# EAGLE design amiga_external_floppy_adapter_rev1 (EAGLE 9.7.0)
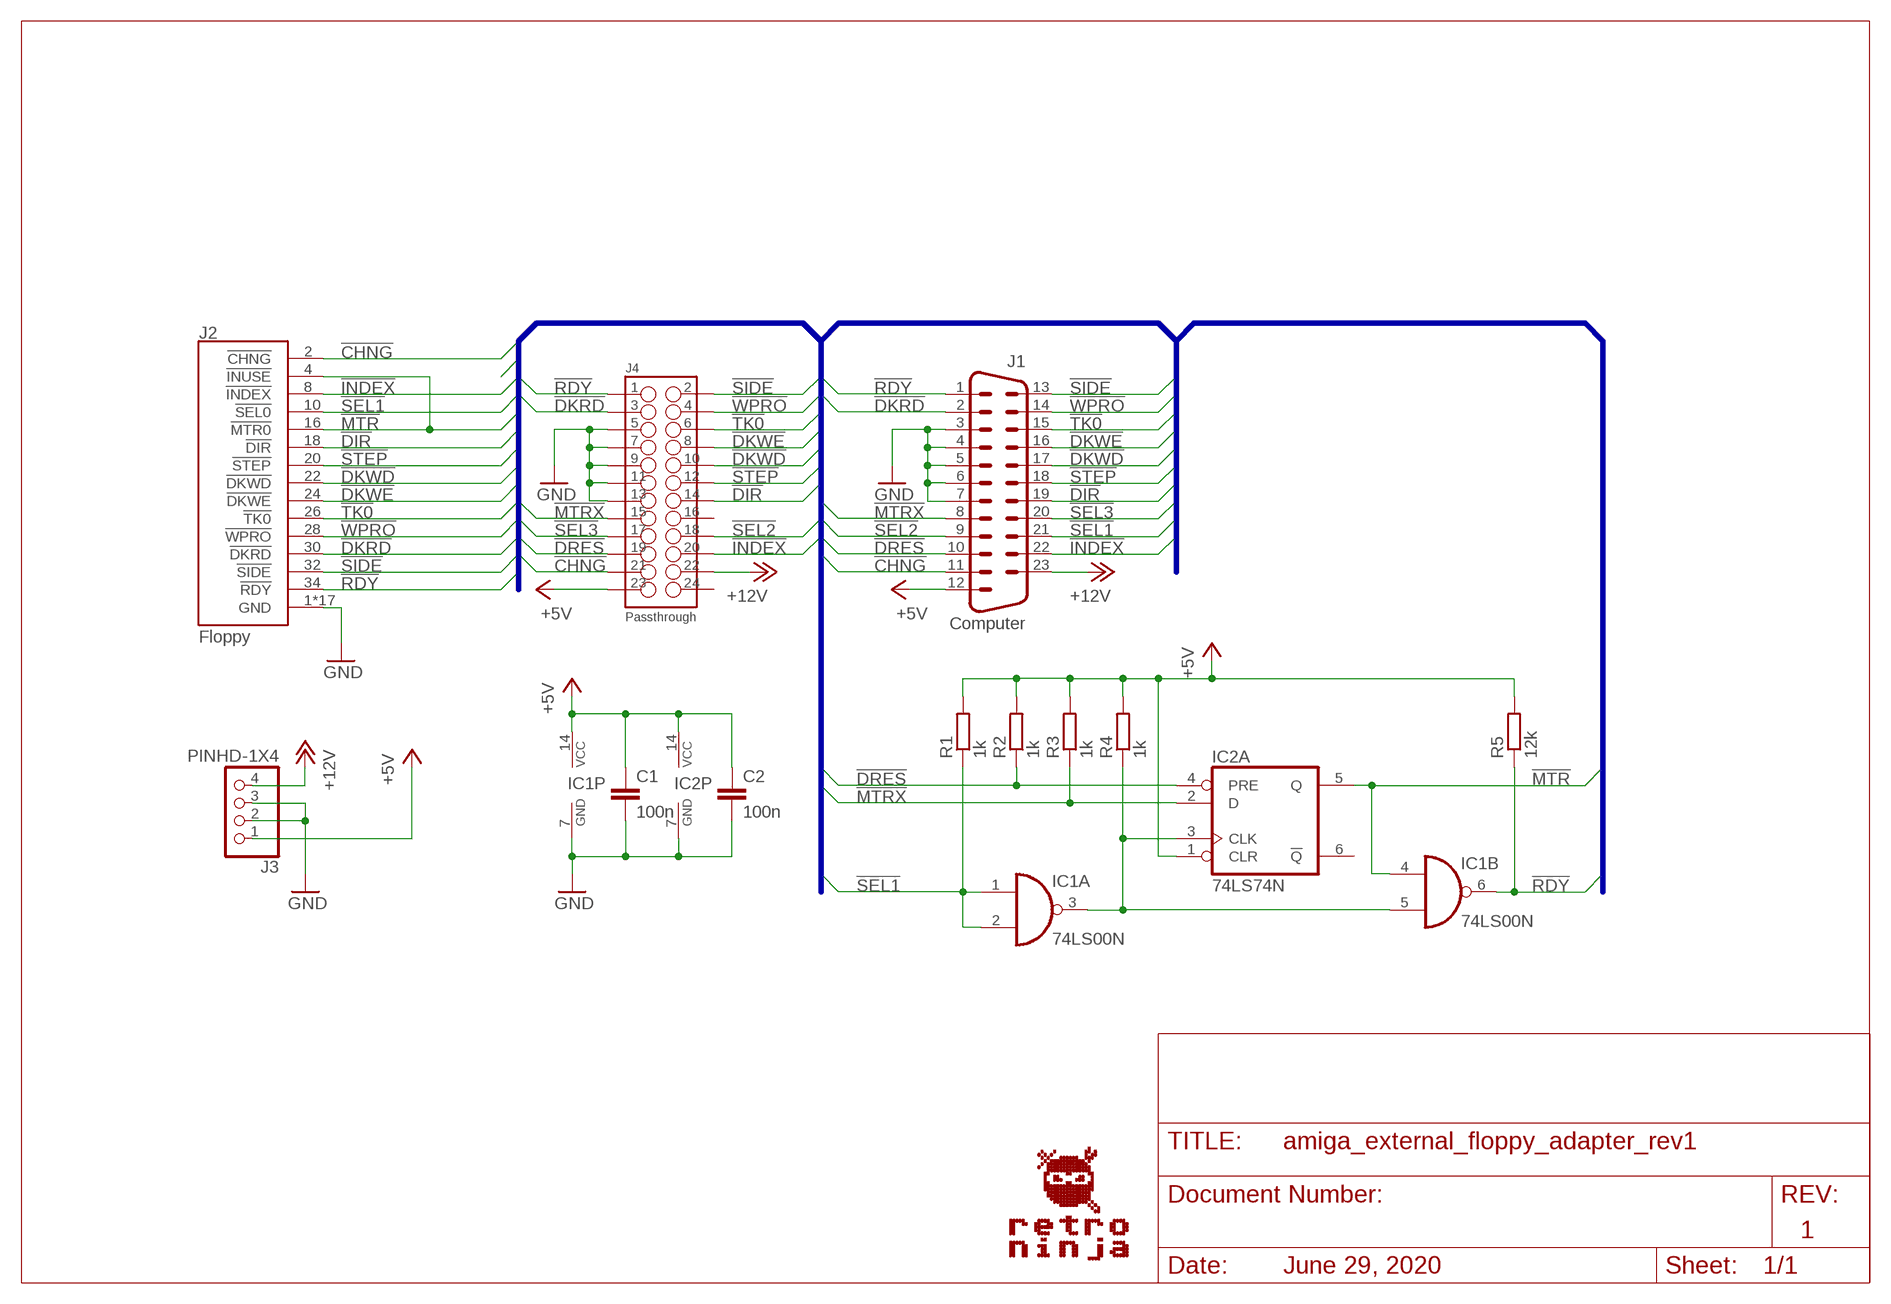
[diagram p0: schematic, sheet 1]

## Parts
C1  100n  C-EU025-025X050  [C025-025X050]
C2  100n  C-EU025-025X050  [C025-025X050]
IC1  74LS00N  [DIL14]
IC2  74LS74N  [DIL14]
J1  Computer  DSUB_M23  [DSUB_M23D]
J2  Floppy  AMIGA_FLOPPYDRV_CONNECTOR/IDC  [HEADER_2X17_WALLED]
J3  PINHD-1X4  [1X04]
J4  Passthrough  HEADER_2X12/IDC  [HEADER_2X12_WALLED]
R1  1k  R-EU_0207/10  [0207/10]
R2  1k  R-EU_0207/10  [0207/10]
R3  1k  R-EU_0207/10  [0207/10]
R4  1k  R-EU_0207/10  [0207/10]
R5  12k  R-EU_0207/10  [0207/10]

## Nets
!CHNG: J1.11 J2.2(!CHNG) J4.21
!DIR: J1.19 J2.18(!DIR) J4.14
!DKRD: J1.2 J2.30(!DKRD) J4.3
!DKWD: J1.17 J2.22(!DKWD) J4.10
!DKWE: J1.16 J2.24(!DKWE) J4.8
!DRES: IC2.4(A:PRE) J1.10 J4.19 R2.1
!INDEX: J1.22 J2.8(!INDEX) J4.20
!MTR: IC1.4(B:I0) IC2.5(A:Q) J2.4(!INUSE) J2.16(!MTR0)
!MTRX: IC2.2(A:D) J1.8 J4.15 R3.1
!RDY: IC1.6(B:O) J1.1 J2.34(!RDY) J4.1 R5.1
!SEL1: IC1.1(A:I0) IC1.2(A:I1) J1.21 J2.10(!SEL0) R1.1
!SEL2: J1.9 J4.18
!SEL3: J1.20 J4.17
!SIDE: J1.13 J2.32(!SIDE) J4.2
!STEP: J1.18 J2.20(!STEP) J4.12
!TK0: J1.15 J2.26(!TK0) J4.6
!WPRO: J1.14 J2.28(!WPRO) J4.4
+5V: C1.1 C2.1 IC1.14(P:VCC) IC2.1(A:CLR) IC2.14(P:VCC) J1.12 J3.1 J4.23 R1.2 R2.2 R3.2 R4.2 R5.2
+12V: J1.23 J3.4 J4.22
GND: C1.2 C2.2 IC1.7(P:GND) IC2.7(P:GND) J1.3 J1.4 J1.5 J1.6 J1.7 J2.1(GND) J2.3(GND) J2.5(GND) J2.7(GND) J2.9(GND) J2.11(GND) J2.13(GND) J2.15(GND) J2.17(GND) J2.19(GND) J2.21(GND) J2.23(GND) J2.25(GND) J2.27(GND) J2.29(GND) J2.31(GND) J2.33(GND) J3.2 J3.3 J4.5 J4.7 J4.9 J4.11 J4.13
N$1: IC1.3(A:O) IC1.5(B:I1) IC2.3(A:CLK) R4.1
Unconnected: IC1.8(C:O) IC1.9(C:I0) IC1.10(C:I1) IC1.11(D:O) IC1.12(D:I0) IC1.13(D:I1) IC2.6(A:!Q) IC2.8(B:!Q) IC2.9(B:Q) IC2.10(B:PRE) IC2.11(B:CLK) IC2.12(B:D) IC2.13(B:CLR) J4.16 J4.24

## Buses
DATA:!CHNG,!DIR,!DKRD,!DKWD,!DKWE,!DRES,!INDEX,!INUSE,!MTR,!MTRX,!RDY,!SEL1,!SEL2,!SEL3,!SIDE,!STEP,!TK0,!WPRO

## Notes on the sheet
- 1
- June 29, 2020

## Library data of the parts
C1 C2 = rcl:C-EU: CAPACITOR, European symbol; SPICEPREFIX: C
IC1 = 74xx-eu:74*00: Quad 2-input NAND gate
IC2 = 74xx-eu:74*74: Dual D type positive edge triggered FLIP FLOP, preset and clear
J1 = Per (Fusion 360):DSUB_M23
J2 = Per (Fusion 360):AMIGA_FLOPPYDRV_CONNECTOR
J3 = Connector:PINHD-1X4: PIN HEADER; CATEGORY: CONNECTOR; SUB-CATEGORY: PIN-HEADER
J4 = Per (Fusion 360):HEADER_2X12
R1-R5 = rcl:R-EU_: RESISTOR, European symbol; SPICEPREFIX: R

## Board
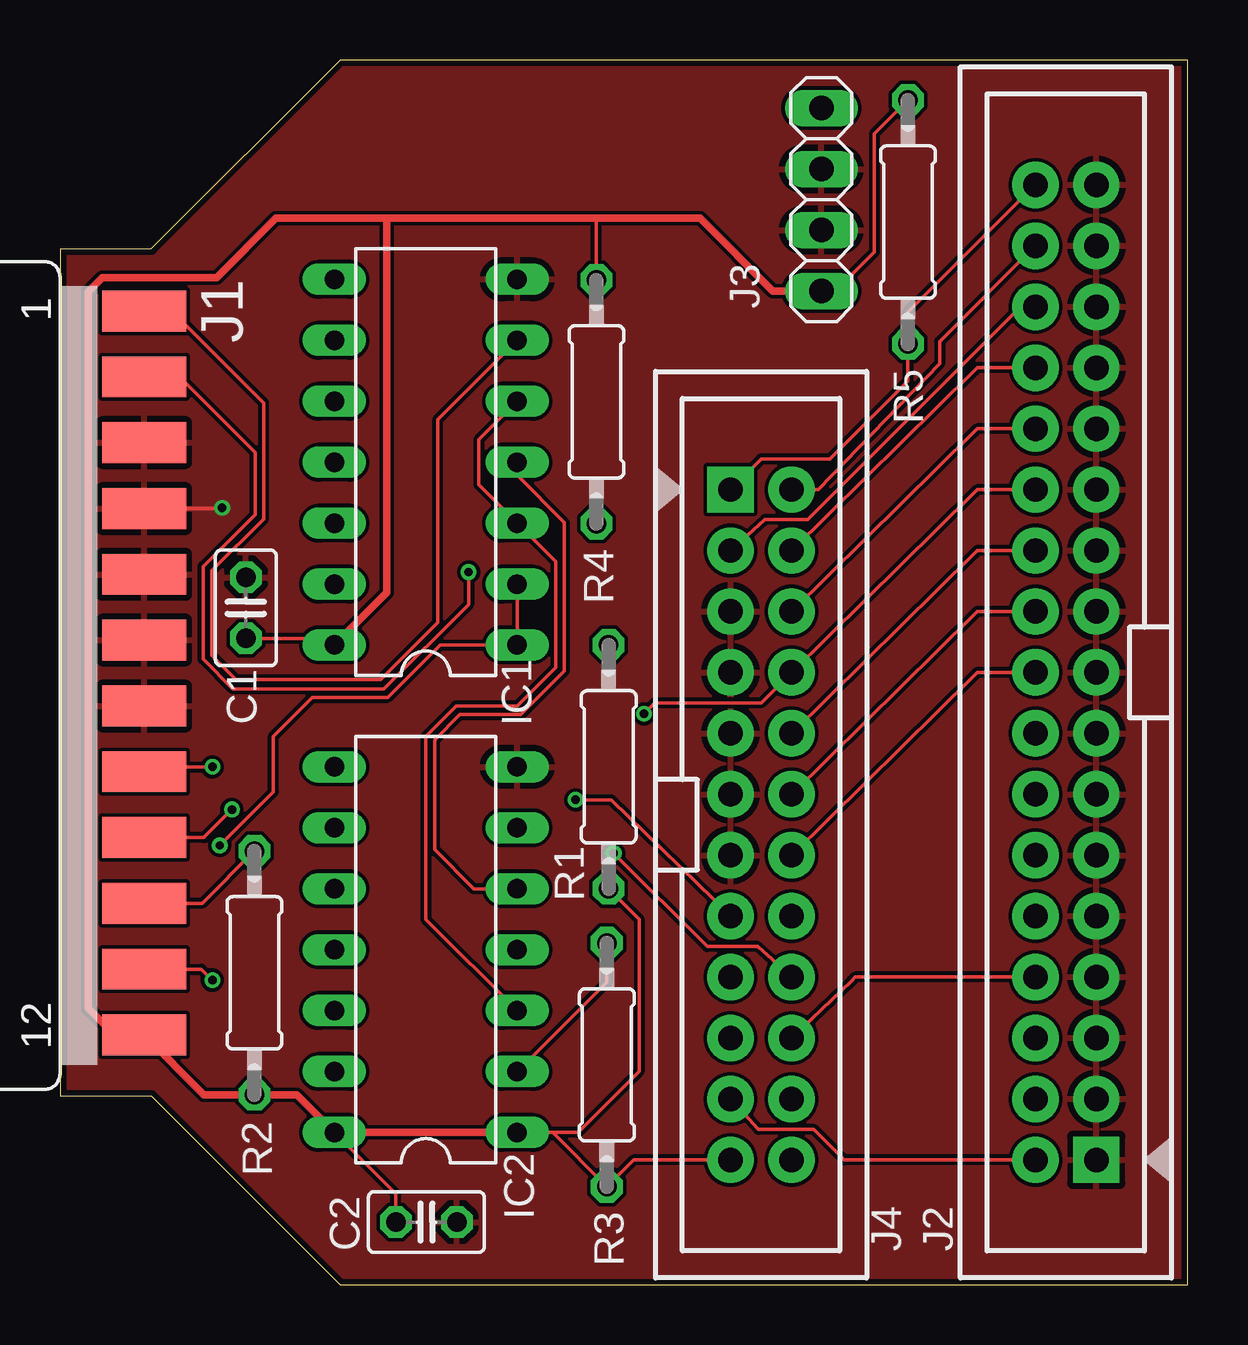
[diagram p1: board, top side]
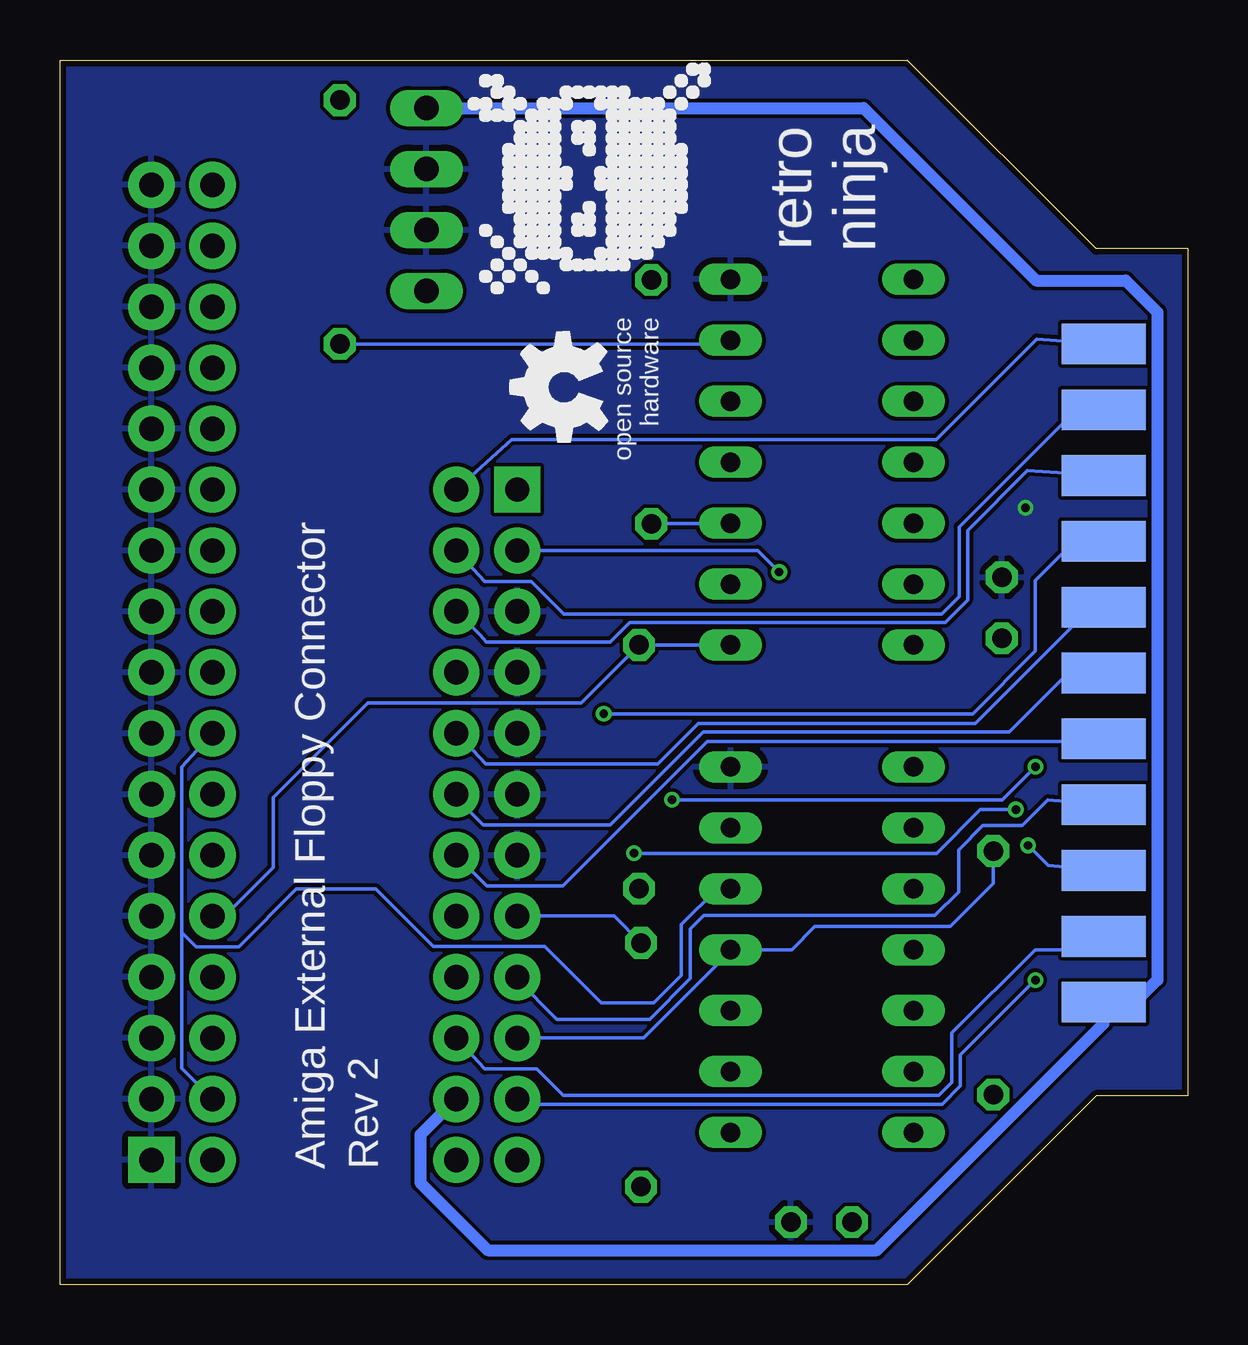
[diagram p2: board, bottom side, seen from below]

Size 46.99 x 51.05 mm. Coordinates in mm from the lower left corner, seen from the top.
Outline: 11.68,0 46.99,0 46.99,51.05 11.68,51.05 3.81,43.18 0,43.18 0,7.87 3.81,7.87 11.68,0
Copper layers (1*16): Top 0.035mm / dielectric 1.5mm / Bottom 0.035mm
Design rules "SeeedStudio_2layer_DRU_no_angle_20140221": minimum track width 6mil, minimum drill 12mil, track to track 6mil, track to pad 6mil, pad to pad 6mil, via to via 6mil, smd to smd 0mil, copper to edge 10mil, drill to drill 10mil, minimum pad ring 10mil, minimum via ring 6mil, stop-mask expansion 2mil, vias tented up to drill 100mil, thermal gap 10mil

### Footprints (pad centres in the part's own frame; a part is rotated, then mirrored left to right if it is on the bottom)
C025-025X050 = drill 0.813 octagon: 1 -1.27,0; 2 1.27,0
DIL14 = drill 0.813 long: 1 -7.62,-3.81; 2 -5.08,-3.81; 3 -2.54,-3.81; 4 0,-3.81; 5 2.54,-3.81; 6 5.08,-3.81; 7 7.62,-3.81; 8 7.62,3.81; 9 5.08,3.81; 10 2.54,3.81; 11 0,3.81; 12 -2.54,3.81; 13 -5.08,3.81; 14 -7.62,3.81
DSUB_M23D = smd 1.7 x 3.5: 1 17.729,-12.395; 2 14.986,-12.395; 3 12.243,-12.395; 4 9.5,-12.395; 5 6.756,-12.395; 6 4.013,-12.395; 7 1.27,-12.395; 8 -1.473,-12.395; 9 -4.216,-12.395; 10 -6.96,-12.395; 11 -9.703,-12.395; 12 -12.446,-12.395 | smd 1.7 x 3.5 bottom: 13 16.358,-12.395; 14 13.614,-12.395; 15 10.871,-12.395; 16 8.128,-12.395; 17 5.385,-12.395; 18 2.642,-12.395; 19 -0.102,-12.395; 20 -2.845,-12.395; 21 -5.588,-12.395; 22 -8.331,-12.395; 23 -11.074,-12.395
HEADER_2X17_WALLED = drill 1.016 pad 1.93 square: 1 -5.08,-1.27 | drill 1.016 pad 1.93: 2 -5.08,1.27; 3 -2.54,-1.27; 4 -2.54,1.27; 5 0,-1.27; 6 0,1.27; 7 2.54,-1.27; 8 2.54,1.27; 9 5.08,-1.27; 10 5.08,1.27; 11 7.62,-1.27; 12 7.62,1.27; 13 10.16,-1.27; 14 10.16,1.27; 15 12.7,-1.27; 16 12.7,1.27; 17 15.24,-1.27; 18 15.24,1.27; 19 17.78,-1.27; 20 17.78,1.27; 21 20.32,-1.27; 22 20.32,1.27; 23 22.86,-1.27; 24 22.86,1.27; 25 25.4,-1.27; 26 25.4,1.27; 27 27.94,-1.27; 28 27.94,1.27; 29 30.48,-1.27; 30 30.48,1.27; 31 33.02,-1.27; 32 33.02,1.27; 33 35.56,-1.27; 34 35.56,1.27
1X04 = drill 1.016 long: 1 -3.81,0; 2 -1.27,0; 3 1.27,0; 4 3.81,0
HEADER_2X12_WALLED = drill 1.016 pad 1.93 square: 1 -13.97,-1.27 | drill 1.016 pad 1.93: 2 -13.97,1.27; 3 -11.43,-1.27; 4 -11.43,1.27; 5 -8.89,-1.27; 6 -8.89,1.27; 7 -6.35,-1.27; 8 -6.35,1.27; 9 -3.81,-1.27; 10 -3.81,1.27; 11 -1.27,-1.27; 12 -1.27,1.27; 13 1.27,-1.27; 14 1.27,1.27; 15 3.81,-1.27; 16 3.81,1.27; 17 6.35,-1.27; 18 6.35,1.27; 19 8.89,-1.27; 20 8.89,1.27; 21 11.43,-1.27; 22 11.43,1.27; 23 13.97,-1.27; 24 13.97,1.27
0207/10 = drill 0.813 octagon: 1 -5.08,0; 2 5.08,0

### Placement (x,y rotation side)
C1  7.75,28.22 90 top
C2  15.27,2.62 0 top
IC1  15.24,34.29 90 top
IC2  15.24,13.97 90 top
J1  -8.89,22.86 90 top
J2  41.91,10.29 90 top
J3  31.72,45.24 90 top
J4  29.21,19.18 270 top
R1  22.86,21.59 270 top
R2  8.1,13 270 top
R3  22.78,9.17 270 top
R4  22.35,36.8 90 top
R5  35.33,44.3 90 top
U$1  [RETRONINJA_NOTEXT_10MM]  19.94,41.35 90 bottom
U$2  [OSHW_5MM]  25.98,37.41 90 bottom

### Tracks (layer width: path | path; a pad name or v marks a point on that pad's centre or on a via)
!CHNG  (via drill 0.35)
  Top 0.152: J4.21 29.09,6.48 31.41,6.48 32.68,5.21 J2.2 | v6.35,12.7 5.89,13.16 J1.11
  Bottom 0.152: J4.21 27.88,7.52 10.24,7.52 9.47,8.29 9.47,9.58 v6.35,12.7
!DIR
  Top 0.152: J4.14 38.1,25.4 38.23,25.53 J2.18
  Bottom 0.152: J1.19 3.81,22.66 20.03,22.66 26.05,16.64 29.21,16.64 J4.14
!DKRD  (via drill 0.35)
  Top 0.152: J4.3 29.37,31.9 31.17,31.9 40.03,40.77 J2.30 | v17.02,29.71 17.02,28.37 13.5,24.84 7.2,24.84 5.97,26.08 5.97,29.94 8.13,32.1 8.13,34.7 4.98,37.85 J1.2
  Bottom 0.152: J4.3 17.92,30.61 v17.02,29.71
!DKWD
  Top 0.152: J4.10 38.1,30.48 38.23,30.61 J2.22
  Bottom 0.152: J1.17 4.14,27.61 4.64,27.61 8.86,23.39 20.4,23.39 22.07,21.72 29.26,21.72 29.77,22.28 J4.10
!DKWE  (via drill 0.35)
  Top 0.152: v24.33,23.8 v24.33,23.81 24.78,24.26 29.21,24.26 J4.8 38.1,33.02 38.23,33.15 J2.24
  Bottom 0.152: J1.16 4.52,31.19 6.35,29.36 6.35,26.41 8.96,23.8 v24.33,23.8
!DRES
  Top 0.152: R2.1 5.92,15.9 J1.10
  Bottom 0.152: R2.1 8.1,16.74 9.91,14.94 15.54,14.94 16.51,13.97 IC2.4 19.05,13.91 22.67,10.29 J4.19
!INDEX
  Top 0.152: J4.20 32.99,12.67 33.15,12.83 J2.8
  Bottom 0.152: J1.22 4.27,13.97 6.35,13.97 9.83,10.49 9.83,8.45 10.38,7.9 26.02,7.9 27.12,8.99 29.3,8.99 J4.20
!MTR
  Top 0.152: IC1.4 19.05,33.74 21.01,31.78 21.01,25.58 19.2,23.77 16.66,23.77 15.61,22.72 15.61,18.14 17.24,16.51 IC2.5
  Bottom 0.152: IC2.5 19.61,16.51 21.11,15.01 21.11,12.89 22.24,11.76 24.44,11.76 26.78,14.1 31.43,14.1 33.84,16.51 37.14,16.51 39.55,14.1 41.31,14.1 41.91,14.7 | 41.91,14.7 41.91,21.59 J2.16 | J2.4 41.91,9.02 41.91,14.7
!MTRX  (via drill 0.35)
  Top 0.152: R3.1 22.78,12.6 19.07,8.89 IC2.2 | J1.8 3.71,21.59 v6.35,21.59 | v21.48,20.21 22.96,20.21 J4.15
  Bottom 0.152: v6.35,21.59 7.72,20.21 v21.48,20.21 | J4.15 23.9,15.37 R3.1
!RDY
  Top 0.152: IC1.6 15.75,36.07 15.75,27.6 13.37,25.22 7.33,25.22 6.33,26.23 6.33,29.77 8.48,31.93 8.48,36.75 4.65,40.59 J1.1 | J4.1 29.21,34.42 32.08,34.42 35.33,37.67 R5.1 35.33,40.54 J2.34
  Bottom 0.152: IC1.6 19.2,39.22 R5.1
!SEL1  (via drill 0.35)
  Top 0.152: IC1.2 IC1.1 15.83,26.67 13.65,24.48 10.51,24.48 8.89,22.86 8.89,20.55 v6.66,18.31
  Bottom 0.152: IC1.1 R1.1 25.27,24.26 34.16,24.26 38.1,20.32 38.1,17.4 40.13,15.37 J2.10 | v6.66,18.31 5.82,17.48 J1.21
!SEL2  (via drill 0.35)
  Top 0.152: J4.18 29.07,14.1 26.96,14.1 v23.07,17.99 | v7.16,19.81 6,18.64 J1.9
  Bottom 0.152: v23.07,17.99 10.46,17.99 8.64,19.81 v7.16,19.81
!SEL3
  Bottom 0.152: J4.17 27.93,12.7 26.3,11.07 22.42,11.07 20.73,12.77 20.73,14.84 20.17,15.39 10.54,15.39 9.55,16.38 9.55,18.14 8.53,19.15 6.89,19.15 5.82,20.22 J1.20
!SIDE
  Top 0.152: J4.2 31.59,33.15 36.65,38.4 36.65,39.32 J2.32
  Bottom 0.152: J1.13 6.3,39.42 10.49,35.23 28.16,35.23 J4.2
!STEP
  Top 0.152: J4.12 38.1,27.94 38.23,28.07 J2.20
  Bottom 0.152: J1.18 4.78,25.7 7.44,23.04 20.19,23.04 24.05,19.18 29.35,19.18 30.48,20.3 J4.12
!TK0
  Top 0.152: J4.6 38.1,35.56 38.23,35.69 J2.26
  Bottom 0.152: J1.15 6.68,33.93 9.17,31.44 9.17,28.55 10.11,27.61 23.25,27.61 24.07,26.8 29.23,26.8 29.49,27.08 J4.6
!WPRO
  Top 0.152: J4.4 38.1,38.1 38.23,38.23 J2.28
  Bottom 0.152: J1.14 4.44,36.68 9.53,31.59 9.53,28.7 10.26,27.97 26,27.97 27.35,29.31 29.3,29.31 J4.4
+5V
  Top 0.152: C1.1 11.15,26.95 IC1.14 | R4.2 22.35,44.45 | C2.1 13.99,3.79 IC2.14 | R1.2 24.13,15.24 24.13,8.89 21.59,6.35 IC2.1 20.52,6.35 R3.2 23.9,5.21 J4.23 | R5.2 33.93,47.98 33.93,43.05 32.31,41.43 J3.1
  Top 0.305: IC2.1 IC2.14 9.86,7.92 R2.2 5.99,7.92 J1.12 2.29,10.41 1.17,11.53 1.17,41.39 1.77,41.99 6.53,41.99 9,44.45 13.61,44.45 | J3.1 29.69,41.43 26.67,44.45 22.35,44.45 13.61,44.45 | IC1.14 13.61,28.85 13.61,44.45
+12V
  Bottom 0.508: J4.22 31.98,6.26 31.98,4.26 29.17,1.45 12.95,1.45 3.5,10.9 3.5,11.43 | 3.5,11.43 J1.23 | J3.4 13.51,49.05 6.32,41.86 2.59,41.86 1.27,40.54 1.27,12.7 2.54,11.43 3.5,11.43
GND  (via drill 0.35)
  Top 0.152: J1.4 6.73,32.36 v6.76,32.38
  pour Top: 0,0 46.99,0 46.99,52.07 0,52.07
  pour Bottom: 0,-1.27 46.99,-1.27 46.99,52.07 0,52.07
N$1
  Top 0.152: IC2.3 15.24,15.24 15.24,22.86 16.51,24.13 19.05,24.13 20.65,25.73 20.65,30.15 IC1.3 17.45,33.35 17.45,35.23 IC1.5
  Bottom 0.152: R4.1 19.07,31.73 IC1.3

### Text on the board
bPlace: retro / ninja | Rev 2 | Amiga External Floppy Connector